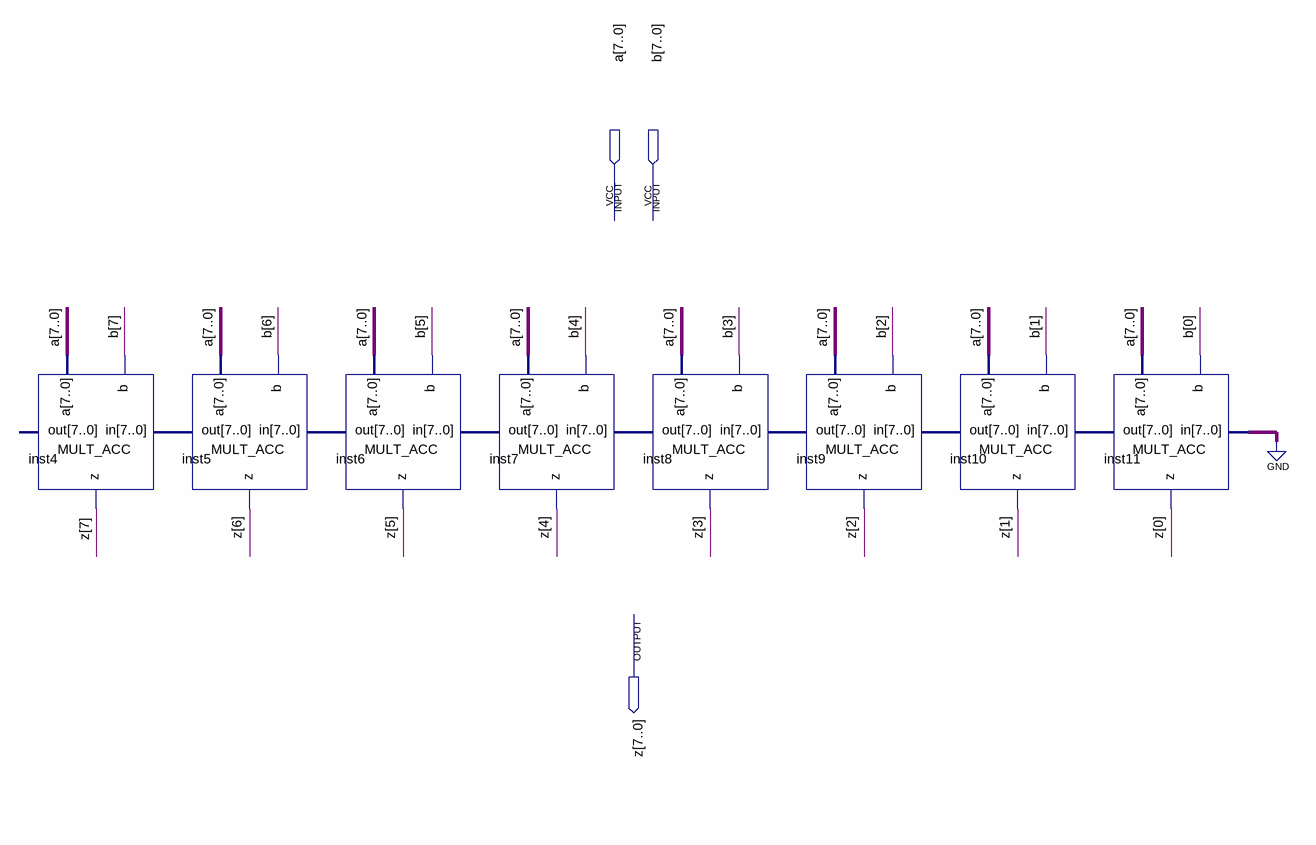
[diagram p0: schematic sheet]
// Quartus schematic MULT_8x8.bdf as structural Verilog: 8 symbols, 3 pins
module MULT_8x8 (
  input  [7:0] a,
  input  [7:0] b,
  output [7:0] z
);

  wire [7:0] inst5_out, inst6_out, inst7_out, inst8_out, inst9_out, inst10_out, inst11_out;

  MULT_ACC inst4 (.a(a), .in(inst5_out), .b(b[7]), .z(z[7]));  // open: out
  MULT_ACC inst5 (.a(a), .in(inst6_out), .b(b[6]), .out(inst5_out), .z(z[6]));
  MULT_ACC inst6 (.a(a), .in(inst7_out), .b(b[5]), .out(inst6_out), .z(z[5]));
  MULT_ACC inst7 (.a(a), .in(inst8_out), .b(b[4]), .out(inst7_out), .z(z[4]));
  MULT_ACC inst8 (.a(a), .in(inst9_out), .b(b[3]), .out(inst8_out), .z(z[3]));
  MULT_ACC inst9 (.a(a), .in(inst10_out), .b(b[2]), .out(inst9_out), .z(z[2]));
  MULT_ACC inst10 (.a(a), .in(inst11_out), .b(b[1]), .out(inst10_out), .z(z[1]));
  MULT_ACC inst11 (.a(a), .in({8{1'b0}}), .b(b[0]), .out(inst11_out), .z(z[0]));
endmodule
